# EAGLE design controllerLayoutSchematic (EAGLE 6.0)
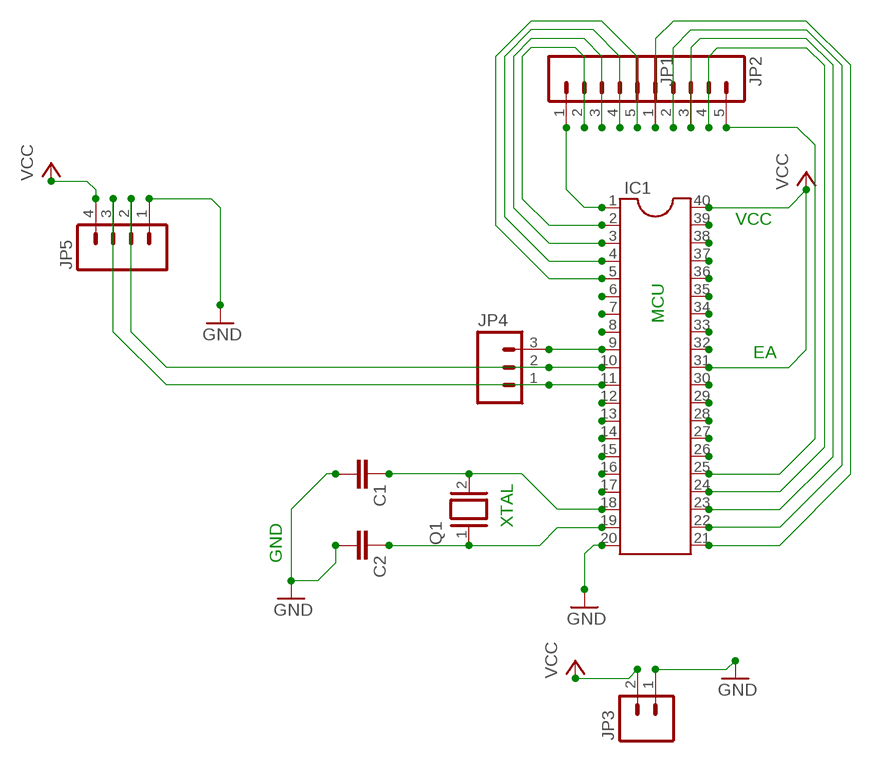
[diagram p0: schematic, sheet 1]

## Parts
C1  CAPPTH2  [CAP-PTH-SMALL2]
C2  CAPPTH2  [CAP-PTH-SMALL2]
IC1  DIL40  [DIL40]
JP1  M05PTH_LONGPADS  [1X05_LONGPADS]
JP2  M05PTH_LONGPADS  [1X05_LONGPADS]
JP3  M02PTH3  [1X02_LONGPADS]
JP4  M03LONGPADS  [1X03_LONGPADS]
JP5  M04SMD  [1X04-SMD]
Q1  XTAL  [Q]

## Nets
GND: C1.2 C2.2 IC1.20 JP3.1 JP5.1
N$1: IC1.1 JP1.1
N$6: IC1.6
N$7: IC1.7
N$8: IC1.8
N$9: IC1.9 JP4.3
N$10: IC1.10 JP4.2 JP5.2
N$11: IC1.11 JP4.1 JP5.3
N$12: IC1.12
N$13: IC1.13
N$14: IC1.14
N$15: IC1.15
N$16: IC1.16
N$17: IC1.17
N$18: C1.1 IC1.18 Q1.2
N$21: IC1.21 JP2.1
N$23: IC1.23 JP2.3
N$25: IC1.25 JP2.5
N$26: IC1.26
N$27: IC1.27
N$28: IC1.28
N$29: IC1.29
N$30: IC1.30
N$32: IC1.32
N$33: IC1.33
N$34: IC1.34
N$35: IC1.35
N$36: IC1.36
N$37: IC1.37
N$38: IC1.38
N$39: IC1.39
N$42: IC1.24 JP2.4
N$44: IC1.22 JP2.2
N$46: IC1.5 JP1.5
N$47: IC1.4 JP1.4
N$48: IC1.3 JP1.3
N$49: IC1.2 JP1.2
N$56: C2.1 IC1.19 Q1.1
VCC: IC1.31 IC1.40 JP3.2 JP5.4

## Notes on the sheet
- VCC
- MCU
- EA
- XTAL
- GND

## Library data of the parts
C1 C2 = SparkFun-Capacitors:CAP: Capacitor Standard 0603 ceramic capacitor, and 0.1" leaded capacitor.
IC1 = ic-package:DIL40: Dual In Line
JP1 JP2 = SparkFun-Connectors:M05: Header 5 Standard 5-pin 0.1" header. Use with straight break away headers (SKU : PRT-00116), right angle break away headers (PRT-00553), swiss pins (PRT-00743), machine pins (PRT-00117), and female headers (PRT-00115). Molex polarized connector foot print use with SKU : PRT-08230 with associated crimp pins and housings.
JP3 = SparkFun-Connectors:M02: Header 2 Standard 2-pin 0.1" header. Use with straight break away headers (SKU : PRT-00116), right angle break away headers (PRT-00553), swiss pins (PRT-00743), machine pins (PRT-00117), and female headers (PRT-00115). Molex polarized connector foot print use with SKU : PRT-08233 with associated crimp pins and housings.
JP4 = SparkFun-Connectors:M03: Header 3 Standard 3-pin 0.1" header. Use with straight break away headers (SKU : PRT-00116), right angle break away headers (PRT-00553), swiss pins (PRT-00743), machine pins (PRT-00117), and female headers (PRT-00115). Molex polarized connector foot print use with SKU : PRT-08232 with associated crimp pins and housings.
JP5 = SparkFun-Connectors:M04: Header 4 Standard 4-pin 0.1" header. Use with straight break away headers (SKU : PRT-00116), right angle break away headers (PRT-00553), swiss pins (PRT-00743), machine pins (PRT-00117), and female headers (PRT-00115). Molex polarized connector foot print use with SKU : PRT-08231 with associated crimp pins and housings. 1MM SMD Version SKU: PRT-10208
Q1 = special:XTAL: CRYSTAL

## Board
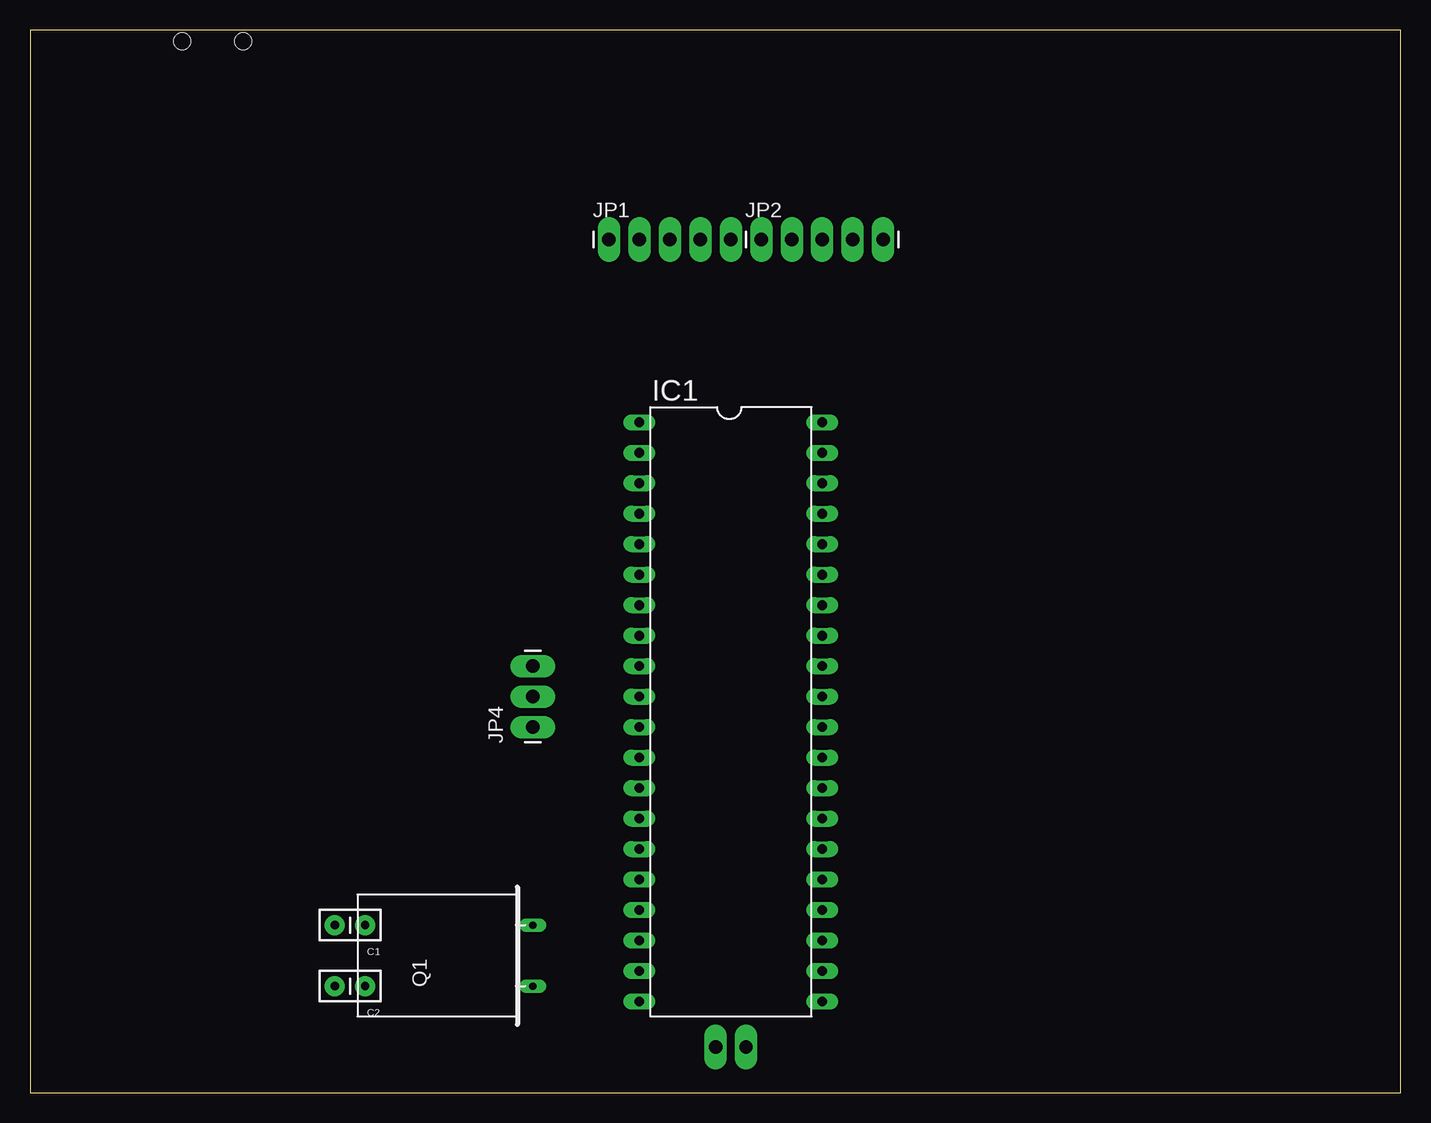
[diagram p1: board, top side]
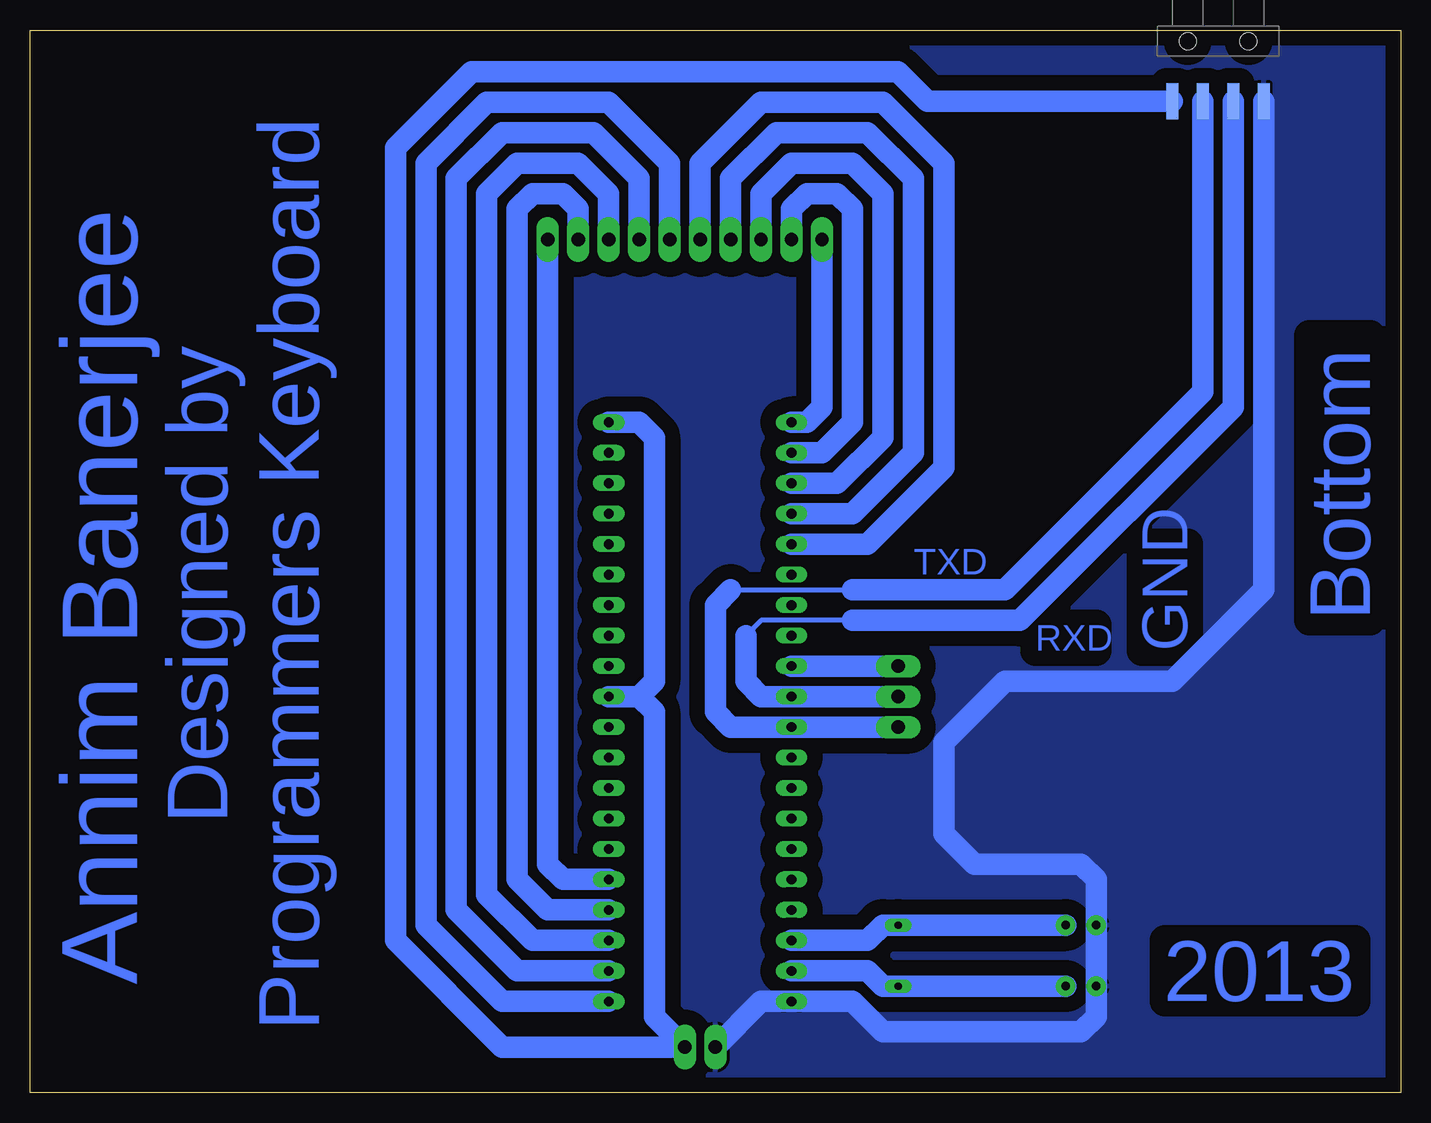
[diagram p2: board, bottom side, seen from below]

Size 114.28 x 88.57 mm. Coordinates in mm from the lower left corner, seen from the top.
Outline: 0,0 114.28,0 114.28,88.57 0,88.57 0,0
Copper layers (1*16): Top 0.035mm / dielectric 1.5mm / Bottom 0.035mm
Design rules: minimum track width 10mil, minimum drill 24mil, track to track 8mil, track to pad 8mil, pad to pad 8mil, via to via 8mil, smd to smd 8mil, copper to edge 40mil, drill to drill 8mil, minimum pad ring 10mil, minimum via ring 8mil, stop-mask expansion 4mil, vias tented up to drill 0mil, thermal gap 10mil

### Footprints (pad centres in the part's own frame; a part is rotated, then mirrored left to right if it is on the bottom)
CAP-PTH-SMALL2 = drill 0.7 pad 1.651: 1 0,0; 2 2.54,0
DIL40 = drill 0.813 long: 1 -24.13,-7.62; 2 -21.59,-7.62; 3 -19.05,-7.62; 4 -16.51,-7.62; 5 -13.97,-7.62; 6 -11.43,-7.62; 7 -8.89,-7.62; 8 -6.35,-7.62; 9 -3.81,-7.62; 10 -1.27,-7.62; 11 1.27,-7.62; 12 3.81,-7.62; 13 6.35,-7.62; 14 8.89,-7.62; 15 11.43,-7.62; 16 13.97,-7.62; 17 16.51,-7.62; 18 19.05,-7.62; 19 21.59,-7.62; 20 24.13,-7.62; 21 24.13,7.62; 22 21.59,7.62; 23 19.05,7.62; 24 16.51,7.62; 25 13.97,7.62; 26 11.43,7.62; 27 8.89,7.62; 28 6.35,7.62; 29 3.81,7.62; 30 1.27,7.62; 31 -1.27,7.62; 32 -3.81,7.62; 33 -6.35,7.62; 34 -8.89,7.62; 35 -11.43,7.62; 36 -13.97,7.62; 37 -16.51,7.62; 38 -19.05,7.62; 39 -21.59,7.62; 40 -24.13,7.62
1X05_LONGPADS = drill 1.118 pad 1.88 long: 1 0,0; 2 2.54,0; 3 5.08,0; 4 7.62,0; 5 10.16,0
1X02_LONGPADS = drill 1.118 pad 1.88 long: 1 0,0; 2 2.54,0
1X03_LONGPADS = drill 1.118 pad 1.88 long: 1 0,0; 2 2.54,0; 3 5.08,0
1X04-SMD = smd 1 x 3: 1 -3.81,5; 2 -1.27,5; 3 1.27,5; 4 3.81,5 | hole 1.4: -2.54,0; 2.54,0
Q = drill 0.61 long: 1 -2.54,-7.62; 2 2.54,-7.62

### Placement (x,y rotation side)
C1  27.94,13.97 180 top
C2  27.94,8.89 180 top
IC1  58.42,31.75 270 top
JP1  48.26,71.12 0 top
JP2  60.96,71.12 0 top
JP3  57.15,3.81 0 top
JP4  41.91,30.48 90 top
JP5  15.24,87.63 180 bottom
Q1  34.29,11.43 90 top

### Tracks (layer width: path | path; a pad name or v marks a point on that pad's centre or on a via)
GND
  Bottom 1.778: JP3.1 53.34,7.62 IC1.20 45.72,7.62 43.18,5.08 26.67,5.08 25.4,6.35 C2.2 C1.2 25.4,17.78 26.67,19.05 35.56,19.05 38.1,21.59 38.1,29.21 33.02,34.29 19.05,34.29 11.43,41.91 JP5.1
  pour Bottom (isolate 1.27): 0,88.9 114.3,88.9 114.3,0 0,0
N$1
  Bottom 1.778: JP1.1 48.26,57.15 49.53,55.88 IC1.1
N$9
  Bottom 1.778: IC1.9 JP4.3
N$10
  Bottom 0.406: 45.72,39.37 53.34,39.37 54.61,38.1
  Bottom 1.778: JP4.2 IC1.10 53.34,33.02 54.61,34.29 54.61,38.1 | JP5.2 13.97,57.15 31.75,39.37 45.72,39.37
N$11
  Bottom 0.406: 55.88,41.91 45.72,41.91
  Bottom 1.778: IC1.11 JP4.1 55.88,30.48 57.15,31.75 57.15,40.64 55.88,41.91 | 45.72,41.91 33.02,41.91 16.51,58.42 JP5.3
N$18
  Bottom 1.778: IC1.18 44.45,12.7 43.18,13.97 Q1.2 C1.1
N$21
  Bottom 1.778: JP2.1 60.96,77.47 66.04,82.55 76.2,82.55 81.28,77.47 81.28,13.97 74.93,7.62 IC1.21
N$23
  Bottom 1.778: JP2.3 66.04,74.93 68.58,77.47 73.66,77.47 76.2,74.93 76.2,16.51 72.39,12.7 IC1.23
N$25
  Bottom 1.778: JP2.5 71.12,19.05 69.85,17.78 IC1.25
N$42
  Bottom 1.778: IC1.24 71.12,15.24 73.66,17.78 73.66,73.66 72.39,74.93 69.85,74.93 68.58,73.66 JP2.4
N$44
  Bottom 1.778: IC1.22 73.66,10.16 78.74,15.24 78.74,76.2 74.93,80.01 67.31,80.01 63.5,76.2 JP2.2
N$46
  Bottom 1.778: JP1.5 58.42,77.47 53.34,82.55 43.18,82.55 38.1,77.47 38.1,52.07 44.45,45.72 IC1.5
N$47
  Bottom 1.778: IC1.4 45.72,48.26 40.64,53.34 40.64,76.2 44.45,80.01 52.07,80.01 55.88,76.2 JP1.4
N$48
  Bottom 1.778: JP1.3 53.34,74.93 50.8,77.47 45.72,77.47 43.18,74.93 43.18,54.61 46.99,50.8 IC1.3
N$49
  Bottom 1.778: IC1.2 48.26,53.34 45.72,55.88 45.72,73.66 46.99,74.93 49.53,74.93 50.8,73.66 JP1.2
N$56
  Bottom 1.778: IC1.19 44.45,10.16 43.18,8.89 Q1.1 C2.1
VCC
  Bottom 1.778: IC1.40 63.5,55.88 62.23,54.61 62.23,34.29 63.5,33.02 | 63.5,33.02 IC1.31 | 63.5,33.02 62.23,31.75 62.23,6.35 JP3.2 74.93,3.81 83.82,12.7 83.82,78.74 77.47,85.09 41.91,85.09 39.45,82.63 JP5.4

### Text on the board
Bottom: Programmers Keyboard | Annim Banerjee | Designed by | TXD | Bottom | GND | RXD | 2013